# Altium schematic sheet VREG.SchDoc
size A
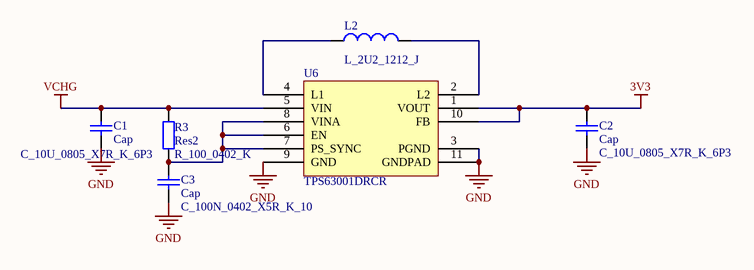
[diagram p0: VREG.SchDoc]

## Parts
C1  Cap  value C_10U_0805_X7R_K_6P3  [C_0805]
C2  Cap  value C_10U_0805_X7R_K_6P3  [C_0805]
C3  Cap  value C_100N_0402_X5R_K_10  [C_0402]
L2  value L_2U2_1212_J  [L_1212]  (hidden comment: Inductor)
R3  Res2  value R_100_0402_K  [R_0402]
U6  TPS63001DRCR  [S-PVSON-N10]

## Nets
3V3: C2.2 U6.1(VOUT) U6.10(FB)
GND: C1.1 C2.1 C3.1 U6.3(PGND) U6.9(GND) U6.11(GNDPAD)
VCHG: C1.2 R3.2 U6.5(VIN)
NetC3_2: C3.2 R3.1 U6.6(EN) U6.7(PS_SYNC) U6.8(VINA)
NetL2_1: L2.1 U6.4(L1)
NetL2_2: L2.2 U6.2(L2)

## Library data of the parts
C1-C3 = Cap: Capacitor; Published: 8-Jun-2000; LatestRevisionDate: 17-Jul-2002; LatestRevisionNote: Re-released for DXP Platform.; Publisher: Altium Limited; Supplier 1: Digi-Key; Supplier 2: Mouser
  C1 C2: Supplier Part Number 1: 490-3904-1-ND; Supplier Part Number 2: 81-GRM21BR70J106KE76
  C3: Supplier Part Number 1: 490-1318-6-ND; Supplier Part Number 2: 81-GRM155R61A104KA01
R3 = Res2: Resistor; Published: 8-Jun-2000; LatestRevisionDate: 17-Jul-2002; LatestRevisionNote: Re-released for DXP Platform.; PackageReference: AXIAL-0.4; Publisher: Altium Limited; PackageDescription: Axial Device, Thru-Hole; 2 Leads; 0.4 in Pin Spacing; Supplier 1: Digi-Key; Supplier Part Number 1: P100JTR-ND; Supplier 2: Mouser; Supplier Part Number 2: 667-ERJ-3GEYJ101V
U6 = TPS63001DRCR: DC/DC Switching Regulators 96% Buck-Boost Conv; Manufacturer: Texas Instruments; Number of Outputs: 1; Output Current: 1.8 A; Output Voltage: 5.5 V; Manufacturer Part Number: TPS63001DRCR; RoHS: RoHS Compliant; Category: DC/DC Switching Regulators; Stock 1: 12364; Pricing 1: 1=3.65, 25=3.33, 100=3.07, 250=2.13, 500=2.02, 1000=1.91 (USD); Package / Case: SON-10; Packaging: Reel; Mounting Style: SMD/SMT; Product Category: Regulators - Non-Isolated Switching DC/DC; Standard Pack Qty: 3000; RoHS - Mouser: Y; Minimum Order Quantity: 1; Reeling: True; ComponentLink1URL: http://focus.ti.com/lit/ds/symlink/tps63000.pdf; ComponentLink1Description: http://focus.ti.com/lit/ds/symlink/tps63000.pdf; Supplier 1: Digi-Key; Supplier Part Number 1: 296-32517-2-ND; Supplier 2: Mouser; Supplier Part Number 2: 595-TPS63001DRCR
L2 = Inductor: Published: 8-Jun-2000; LatestRevisionDate: 29-May-2009; LatestRevisionNote: IPC-7351 Footprint Added.; Publisher: Altium Limited; PackageDescription: Chip Inductor; Supplier 1: Digi-Key; Supplier Part Number 1: 490-5119-1-ND; Supplier 2: Mouser; Supplier Part Number 2: 81-LQH3NPN2R2NG0L